# Altium schematic sheet 6_对外接口.Schdoc
size A4
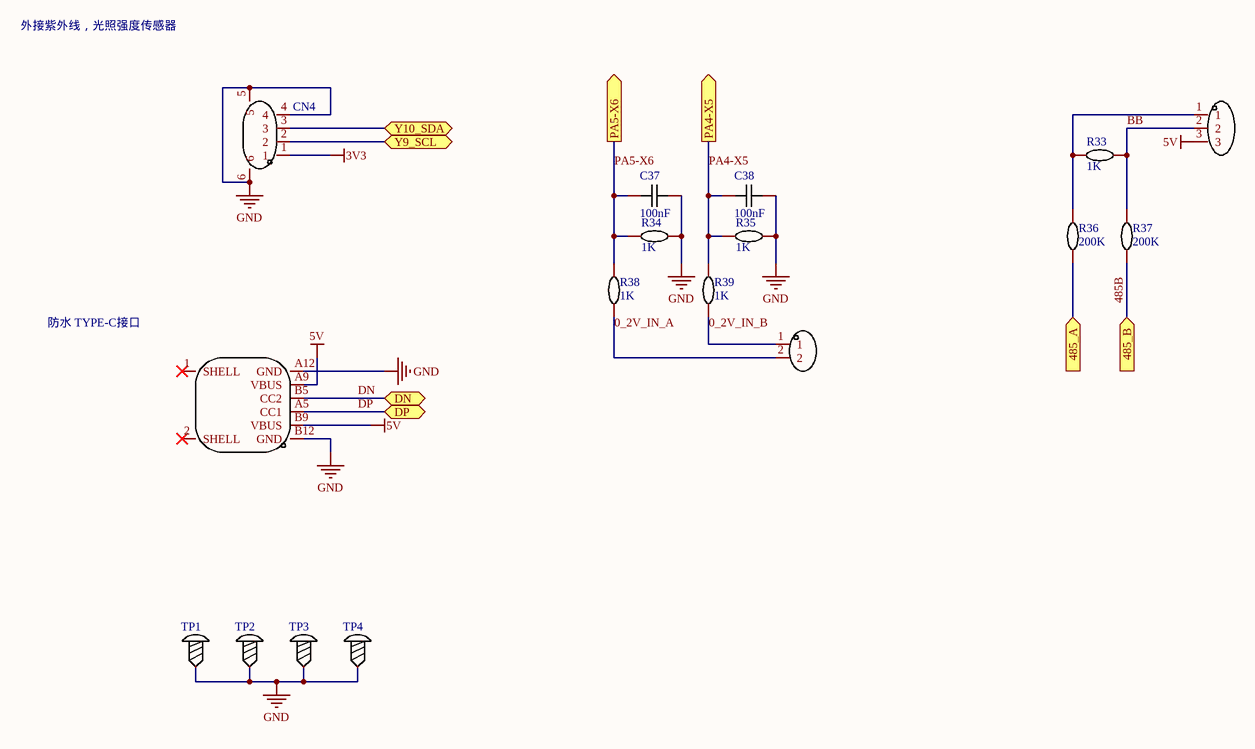
[diagram p0: 6_对外接口.Schdoc]

## Parts
C37  100nF  [0402]
C38  100nF  [0402]
CN4  HX25003-4AWB  [CONN-SMD_4P-P2.50_HX25003-4AWB]  (value not drawn)
CN5  XH-3A  [CONN-TH_XH-3A]  (value not drawn)
CN6  XH-2A  [CONN-TH_2P-P2.50_HCTL_XH-2A-X]  (value not drawn)
R33  1K  [0603R]
R34  1K  [0603R]
R35  1K  [0603R]
R36  200K  [0805]
R37  200K  [0805]
R38  1K  [0603R]
R39  1K  [0603R]
TP1  M3__  [PCBComponent_1 - duplicate]  (value not drawn)
TP2  M3__  [PCBComponent_1 - duplicate]  (value not drawn)
TP3  M3__  [PCBComponent_1 - duplicate]  (value not drawn)
TP4  M3__  [PCBComponent_1 - duplicate]  (value not drawn)
USB2  TYPE-C 6P(040_)  [USB-C-SMD_TYPE-C-6P]  (value not drawn)

## Ports
485_A (in), 485_B (in), DN (bidir), DP (bidir), PA4-X5 (out), PA5-X6 (out), Y9_SCL (bidir), Y10_SDA (bidir)

## Nets
3V3: CN4.1
5V: CN5.3 USB2.A9(VBUS) USB2.B9(VBUS)
GND: C37.2 C38.2 CN4.4 CN4.5 CN4.6 R34.1 R35.1 TP1.1 TP2.1 TP3.1 TP4.1 USB2.A12(GND) USB2.B12(GND)
0_2V_IN_A: CN6.2 R38.1
0_2V_IN_B: CN6.1 R39.1
485_A: R36.1 ; port 485_A
485B: R37.1 ; port 485_B
BB: CN5.2 R33.2 R37.2
DN: USB2.B5(CC2) ; port DN
DP: USB2.A5(CC1) ; port DP
PA4-X5: C38.1 R35.2 R39.2 ; port PA4-X5
PA5-X6: C37.1 R34.2 R38.2 ; port PA5-X6
Y9_SCL: CN4.2 ; port Y9_SCL
Y10_SDA: CN4.3 ; port Y10_SDA
NetCN5_1: CN5.1 R33.1 R36.2

Not connected (* = marked no-connect by the designer): USB2 1(SHELL)* 2(SHELL)*

## Notes on the sheet
- 外接紫外线，光照强度传感器
- 防水 TYPE-C接口

## Library data of the parts
C37 C38 = CAP_0402: Symbol: CapAcitance; Convert to PCB: yes; Device: CAP_0402; Add into BOM: yes; Supplier Footprint: 0402; Value: 100nF; Name: 100nF
CN4 = HX25003-4AWB: Add into BOM: yes; Reference Series: XH; Pitch: 2.5mm; Pins Structure: 1x4P; Number of PINs Per Row: 4; Name: HX25003-4AWB; Symbol: HX25003-4AWB; Device: HX25003-4AWB; Supplier Part: C442363; Manufacturer Part: HX25003-4AWB; Supplier Footprint: SMD,P=2.5mm; JLCPCB Part Class: Extended Part; Datasheet: https://atta.szlcsc.com/upload/public/pdf/source/20191028/C442363_5F1A00A27A9E9A3DE9CAD5B4615D2548.pdf; Supplier: LCSC; Convert to PCB: yes; Number of Rows: 1; Row Spacing: -; Current Rating (Max): -; Operating Temperature Range: -
CN5 = XH-3A: Symbol: XH-3A_C2908601; Add into BOM: yes; Pins Structure: 1x3P; Pitch: 2.5mm; Number of PINs Per Row: 3; Reference Series: XH; Current Rating (Max): 3A; Device: XH-3A; Supplier: LCSC; Supplier Part: C2908601; Manufacturer Part: XH-3A; JLCPCB Part Class: Extended Part; Datasheet: https://atta.szlcsc.com/upload/public/pdf/source/20230711/68D365716984B4AFE576D1D73D61B465.pdf; Convert to PCB: yes; Row Spacing: -; Number of Pins: 3P; Number of Rows: 1
CN6 = XH-2A: Symbol: XH-2A_C2908600; Add into BOM: yes; Pins Structure: 1x2P; Pitch: 2.5mm; Number of PINs Per Row: 2; Reference Series: XH; Current Rating (Max): 3A; Device: XH-2A; Supplier: LCSC; Supplier Part: C2908600; Manufacturer Part: XH-2A; JLCPCB Part Class: Extended Part; Datasheet: https://atta.szlcsc.com/upload/public/pdf/source/20230711/68D365716984B4AFE576D1D73D61B465.pdf; Convert to PCB: yes; Row Spacing: -; Number of Pins: 2P; Number of Rows: 1
R33-R35 R38 R39 = Res_0603: Convert to PCB: yes; Name: 1K; Device: Res_0603; Add into BOM: yes; Supplier Footprint: 0603; Value: 1K
R36 R37 = Res_0805: Convert to PCB: yes; Name: 200K; Device: Res_0805; Add into BOM: yes; Supplier Footprint: 0805; Value: 200K
TP1-TP4 = M3__: Convert to PCB: yes; Add into BOM: yes
USB2 = TYPE-C 6P(040_): Add into BOM: yes; Number of Ports: 1; Current Rating - Power (Max): 3A; Supplier: LCSC; Supplier Part: C2887422; JLCPCB Part Class: Extended Part; Supplier Footprint: SMD; Datasheet: https://atta.szlcsc.com/upload/public/pdf/source/20210820/A6D4675B44FEA528A0512D7C06DEA92E.pdf; Convert to PCB: yes; Connector Type: Type-C; Standard: -; Number of Contacts: 6P